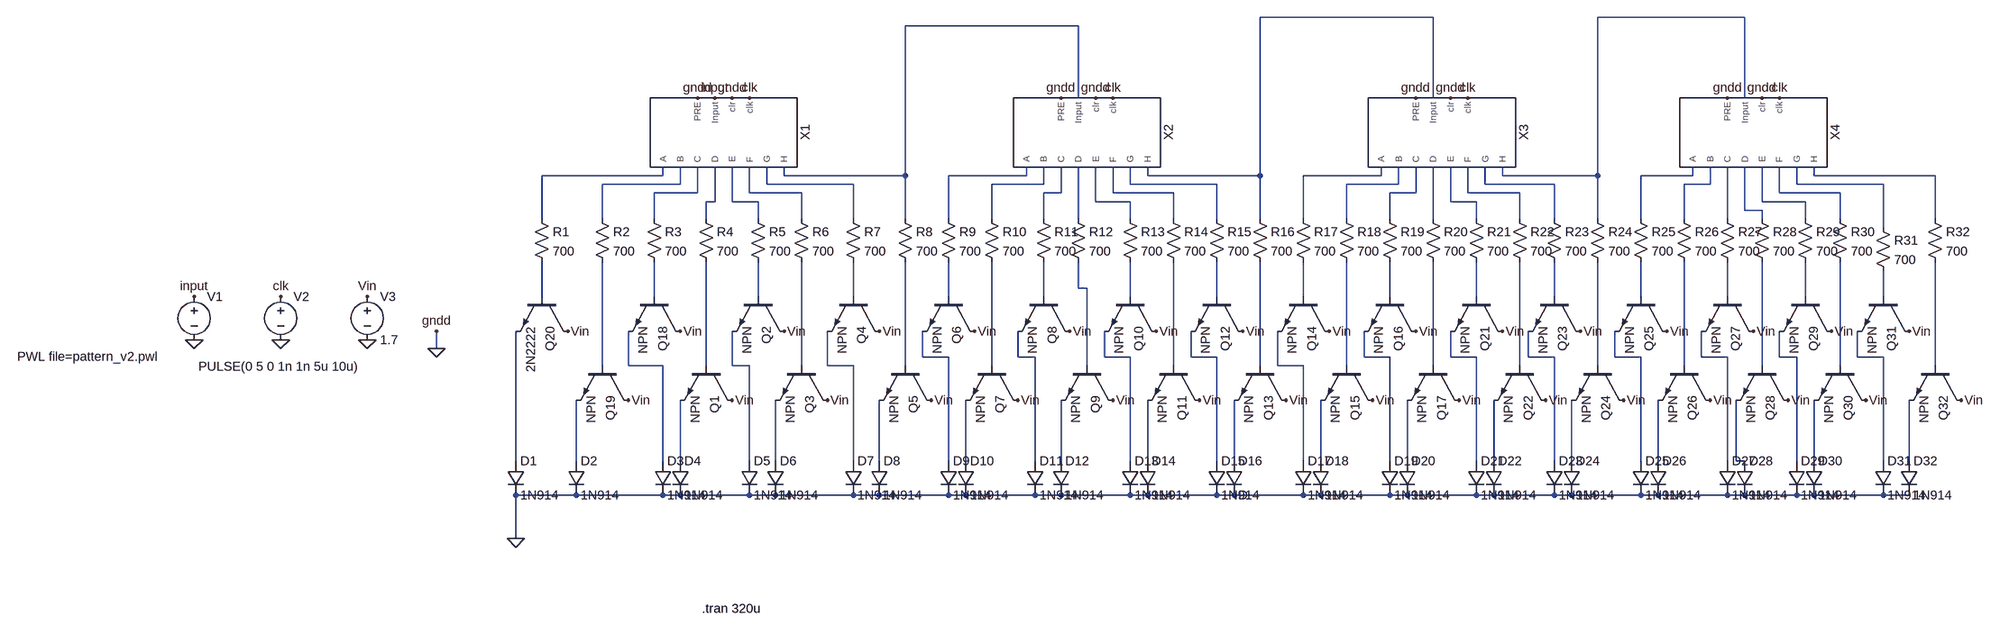
[diagram p0: schematic v2_arduino_control.asc]
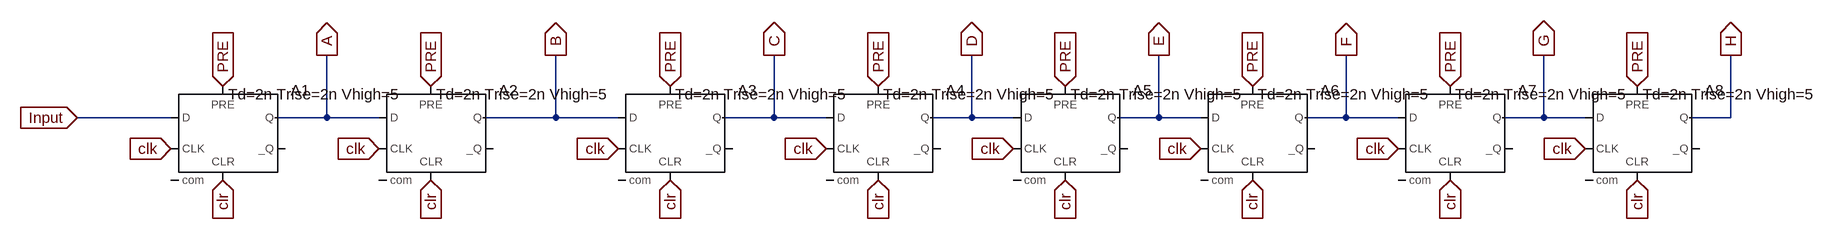
[diagram p1: sub-circuit shift_register.asc]
v2_arduino_control.asc, the LTspice schematic file:
Version 4.1
SHEET 1 2168 1000
WIRE 1120 -144 800 -144
WIRE 1696 -144 1424 -144
WIRE 464 -128 144 -128
WIRE 464 32 464 -128
WIRE 1120 32 1120 -144
WIRE 1696 32 1696 -144
WIRE -304 176 -304 160
WIRE -304 176 -528 176
WIRE -80 176 -80 160
WIRE 144 176 144 -128
WIRE 144 176 -80 176
WIRE 368 176 368 160
WIRE 368 176 224 176
WIRE 592 176 592 160
WIRE 800 176 800 -144
WIRE 800 176 592 176
WIRE 1024 176 1024 160
WIRE 1024 176 880 176
WIRE 1248 176 1248 160
WIRE 1424 176 1424 -144
WIRE 1424 176 1248 176
WIRE 1600 176 1600 160
WIRE 1600 176 1504 176
WIRE 1824 176 1824 160
WIRE 2048 176 1824 176
WIRE -272 192 -272 160
WIRE -272 192 -416 192
WIRE -112 192 -112 160
WIRE 48 192 -112 192
WIRE 400 192 400 160
WIRE 400 192 304 192
WIRE 560 192 560 160
WIRE 720 192 560 192
WIRE 1056 192 1056 160
WIRE 1056 192 960 192
WIRE 1216 192 1216 160
WIRE 1344 192 1216 192
WIRE 1632 192 1632 160
WIRE 1632 192 1584 192
WIRE 1792 192 1792 160
WIRE 1952 192 1792 192
WIRE -240 208 -240 160
WIRE -240 208 -320 208
WIRE -144 208 -144 160
WIRE -48 208 -144 208
WIRE 432 208 432 160
WIRE 432 208 400 208
WIRE 528 208 528 160
WIRE 640 208 528 208
WIRE 1088 208 1088 160
WIRE 1088 208 1040 208
WIRE 1184 208 1184 160
WIRE 1280 208 1184 208
WIRE 1760 208 1760 160
WIRE 1872 208 1760 208
WIRE -208 224 -208 160
WIRE -208 224 -224 224
WIRE -176 224 -176 160
WIRE -128 224 -176 224
WIRE 496 224 496 160
WIRE 560 224 496 224
WIRE 1152 224 1152 160
WIRE 1200 224 1152 224
WIRE 1728 224 1728 160
WIRE 1808 224 1728 224
WIRE 1696 240 1696 160
WIRE 1728 240 1696 240
WIRE -528 256 -528 176
WIRE -416 256 -416 192
WIRE -320 256 -320 208
WIRE -224 256 -224 224
WIRE -128 256 -128 224
WIRE -48 256 -48 208
WIRE 48 256 48 192
WIRE 144 256 144 176
WIRE 224 256 224 176
WIRE 304 256 304 192
WIRE 400 256 400 208
WIRE 464 256 464 160
WIRE 560 256 560 224
WIRE 640 256 640 208
WIRE 720 256 720 192
WIRE 800 256 800 176
WIRE 880 256 880 176
WIRE 960 256 960 192
WIRE 1040 256 1040 208
WIRE 1120 256 1120 160
WIRE 1200 256 1200 224
WIRE 1280 256 1280 208
WIRE 1344 256 1344 192
WIRE 1424 256 1424 176
WIRE 1504 256 1504 176
WIRE 1584 256 1584 192
WIRE 1664 256 1664 160
WIRE 1728 256 1728 240
WIRE 1808 256 1808 224
WIRE 1872 256 1872 208
WIRE 2048 256 2048 176
WIRE 1952 272 1952 192
WIRE 464 384 464 336
WIRE 480 384 464 384
WIRE -528 400 -528 336
WIRE -320 400 -320 336
WIRE -128 400 -128 336
WIRE 48 400 48 336
WIRE 224 400 224 336
WIRE 400 400 400 336
WIRE 560 400 560 336
WIRE 720 400 720 336
WIRE 880 400 880 336
WIRE 1040 400 1040 336
WIRE 1200 400 1200 336
WIRE 1344 400 1344 336
WIRE 1504 400 1504 336
WIRE 1664 400 1664 336
WIRE 1808 400 1808 336
WIRE 1952 400 1952 352
WIRE -816 496 -816 464
WIRE 176 512 176 464
WIRE 224 512 176 512
WIRE 352 512 352 464
WIRE 384 512 352 512
WIRE 512 512 512 464
WIRE 560 512 512 512
WIRE 672 512 672 464
WIRE 720 512 672 512
WIRE 992 512 992 464
WIRE 1040 512 992 512
WIRE 1152 512 1152 464
WIRE 1200 512 1152 512
WIRE 1296 512 1296 464
WIRE 1344 512 1296 512
WIRE 1456 512 1456 464
WIRE 1504 512 1456 512
WIRE 1616 512 1616 464
WIRE 1664 512 1616 512
WIRE 1760 512 1760 464
WIRE 1792 512 1760 512
WIRE 1904 512 1904 464
WIRE 1952 512 1904 512
WIRE -416 528 -416 336
WIRE -368 528 -368 464
WIRE -304 528 -368 528
WIRE -224 528 -224 336
WIRE -176 528 -176 464
WIRE -144 528 -176 528
WIRE -48 528 -48 336
WIRE 0 528 0 464
WIRE 48 528 0 528
WIRE 144 528 144 336
WIRE 304 528 304 336
WIRE 480 528 480 384
WIRE 640 528 640 336
WIRE 800 528 800 336
WIRE 832 528 832 464
WIRE 880 528 832 528
WIRE 960 528 960 336
WIRE 1120 528 1120 336
WIRE 1280 528 1280 336
WIRE 1424 528 1424 336
WIRE 1584 528 1584 336
WIRE 1728 528 1728 336
WIRE 1872 528 1872 336
WIRE 2048 528 2048 336
WIRE -576 704 -576 464
WIRE -464 704 -464 592
WIRE -304 704 -304 528
WIRE -272 704 -272 592
WIRE -144 704 -144 528
WIRE -96 704 -96 592
WIRE 48 704 48 528
WIRE 96 704 96 592
WIRE 224 704 224 512
WIRE 256 704 256 592
WIRE 384 704 384 512
WIRE 432 704 432 592
WIRE 560 704 560 512
WIRE 592 704 592 592
WIRE 720 704 720 512
WIRE 752 704 752 592
WIRE 880 704 880 528
WIRE 912 704 912 592
WIRE 1040 704 1040 512
WIRE 1072 704 1072 592
WIRE 1200 704 1200 512
WIRE 1232 704 1232 592
WIRE 1344 704 1344 512
WIRE 1376 704 1376 592
WIRE 1504 704 1504 512
WIRE 1536 704 1536 592
WIRE 1664 704 1664 512
WIRE 1680 704 1680 592
WIRE 1696 704 1680 704
WIRE 1792 704 1792 512
WIRE 1824 704 1824 592
WIRE 1952 704 1952 512
WIRE 2000 704 2000 592
WIRE -464 768 -576 768
WIRE -304 768 -464 768
WIRE -272 768 -304 768
WIRE -144 768 -272 768
WIRE -96 768 -144 768
WIRE 48 768 -96 768
WIRE 96 768 48 768
WIRE 224 768 96 768
WIRE 256 768 224 768
WIRE 384 768 256 768
WIRE 432 768 384 768
WIRE 560 768 432 768
WIRE 592 768 560 768
WIRE 720 768 592 768
WIRE 752 768 720 768
WIRE 880 768 752 768
WIRE 912 768 880 768
WIRE 1040 768 912 768
WIRE 1072 768 1040 768
WIRE 1200 768 1072 768
WIRE 1232 768 1200 768
WIRE 1344 768 1232 768
WIRE 1376 768 1344 768
WIRE 1504 768 1376 768
WIRE 1536 768 1504 768
WIRE 1664 768 1536 768
WIRE 1696 768 1664 768
WIRE 1792 768 1696 768
WIRE 1824 768 1792 768
WIRE 1952 768 1824 768
WIRE 2000 768 1952 768
WIRE -576 848 -576 768
FLAG -816 496 0
FLAG -816 464 gndd
FLAG -240 32 gndd
FLAG -176 32 gndd
FLAG 432 32 gndd
FLAG 496 32 gndd
FLAG 1088 32 gndd
FLAG 1152 32 gndd
FLAG 1664 32 gndd
FLAG 1728 32 gndd
FLAG -1264 480 0
FLAG -1104 480 0
FLAG -944 480 0
FLAG -1264 400 input
FLAG -208 32 input
FLAG -1104 400 clk
FLAG -144 32 clk
FLAG 528 32 clk
FLAG 1184 32 clk
FLAG 1760 32 clk
FLAG -944 400 Vin
FLAG -480 464 Vin
FLAG -368 592 Vin
FLAG -272 464 Vin
FLAG -176 592 Vin
FLAG -80 464 Vin
FLAG 0 592 Vin
FLAG 96 464 Vin
FLAG 192 592 Vin
FLAG 272 464 Vin
FLAG 352 592 Vin
FLAG 448 464 Vin
FLAG 528 592 Vin
FLAG 608 464 Vin
FLAG 688 592 Vin
FLAG 768 464 Vin
FLAG 848 592 Vin
FLAG 928 464 Vin
FLAG 1008 592 Vin
FLAG 1088 464 Vin
FLAG 1168 592 Vin
FLAG 1248 464 Vin
FLAG 1328 592 Vin
FLAG 1392 464 Vin
FLAG 1552 464 Vin
FLAG 1472 592 Vin
FLAG 1632 592 Vin
FLAG 1712 464 Vin
FLAG 1776 592 Vin
FLAG 1856 464 Vin
FLAG 1920 592 Vin
FLAG 2000 464 Vin
FLAG 2096 592 Vin
FLAG -576 848 0
SYMBOL shift_register -192 96 R90
SYMATTR InstName X1
SYMBOL shift_register 480 96 R90
SYMATTR InstName X2
SYMBOL shift_register 1136 96 R90
SYMATTR InstName X3
SYMBOL shift_register 1712 96 R90
SYMATTR InstName X4
SYMBOL npn -176 528 R90
SYMATTR InstName Q1
SYMBOL npn -80 400 R90
SYMATTR InstName Q2
SYMBOL npn 0 528 R90
SYMATTR InstName Q3
SYMBOL npn 96 400 R90
SYMATTR InstName Q4
SYMBOL npn 192 528 R90
SYMATTR InstName Q5
SYMBOL npn 272 400 R90
SYMATTR InstName Q6
SYMBOL npn 352 528 R90
SYMATTR InstName Q7
SYMBOL npn 448 400 R90
SYMATTR InstName Q8
SYMBOL npn 528 528 R90
SYMATTR InstName Q9
SYMBOL npn 608 400 R90
SYMATTR InstName Q10
SYMBOL npn 688 528 R90
SYMATTR InstName Q11
SYMBOL npn 768 400 R90
SYMATTR InstName Q12
SYMBOL npn 848 528 R90
SYMATTR InstName Q13
SYMBOL npn 928 400 R90
SYMATTR InstName Q14
SYMBOL npn 1008 528 R90
SYMATTR InstName Q15
SYMBOL npn 1088 400 R90
SYMATTR InstName Q16
SYMBOL npn 1168 528 R90
SYMATTR InstName Q17
SYMBOL npn -272 400 R90
SYMATTR InstName Q18
SYMBOL npn -368 528 R90
SYMATTR InstName Q19
SYMBOL npn -480 400 R90
SYMATTR InstName Q20
SYMATTR Value 2N2222
SYMBOL npn 1248 400 R90
SYMATTR InstName Q21
SYMBOL npn 1328 528 R90
SYMATTR InstName Q22
SYMBOL npn 1392 400 R90
SYMATTR InstName Q23
SYMBOL npn 1472 528 R90
SYMATTR InstName Q24
SYMBOL npn 1552 400 R90
SYMATTR InstName Q25
SYMBOL npn 1632 528 R90
SYMATTR InstName Q26
SYMBOL npn 1712 400 R90
SYMATTR InstName Q27
SYMBOL npn 1776 528 R90
SYMATTR InstName Q28
SYMBOL npn 1856 400 R90
SYMATTR InstName Q29
SYMBOL npn 1920 528 R90
SYMATTR InstName Q30
SYMBOL npn 2000 400 R90
SYMATTR InstName Q31
SYMBOL npn 2096 528 R90
SYMATTR InstName Q32
SYMBOL voltage -1264 384 R0
WINDOW 3 -327 127 Left 2
WINDOW 123 0 0 Left 0
WINDOW 39 0 0 Left 0
SYMATTR Value PWL file=pattern_v2.pwl
SYMATTR InstName V1
SYMBOL voltage -1104 384 R0
WINDOW 3 -152 145 Left 2
WINDOW 123 0 0 Left 0
WINDOW 39 0 0 Left 0
SYMATTR Value PULSE(0 5 0 1n 1n 5u 10u)
SYMATTR InstName V2
SYMBOL voltage -944 384 R0
WINDOW 123 0 0 Left 0
WINDOW 39 0 0 Left 0
SYMATTR InstName V3
SYMATTR Value 1.7
SYMBOL res -544 240 R0
SYMATTR InstName R1
SYMATTR Value 700
SYMBOL res -432 240 R0
SYMATTR InstName R2
SYMATTR Value 700
SYMBOL res -336 240 R0
SYMATTR InstName R3
SYMATTR Value 700
SYMBOL res -240 240 R0
SYMATTR InstName R4
SYMATTR Value 700
SYMBOL res -144 240 R0
SYMATTR InstName R5
SYMATTR Value 700
SYMBOL res -64 240 R0
SYMATTR InstName R6
SYMATTR Value 700
SYMBOL res 32 240 R0
SYMATTR InstName R7
SYMATTR Value 700
SYMBOL res 128 240 R0
SYMATTR InstName R8
SYMATTR Value 700
SYMBOL res 208 240 R0
SYMATTR InstName R9
SYMATTR Value 700
SYMBOL res 288 240 R0
SYMATTR InstName R10
SYMATTR Value 700
SYMBOL res 384 240 R0
SYMATTR InstName R11
SYMATTR Value 700
SYMBOL res 448 240 R0
SYMATTR InstName R12
SYMATTR Value 700
SYMBOL res 544 240 R0
SYMATTR InstName R13
SYMATTR Value 700
SYMBOL res 624 240 R0
SYMATTR InstName R14
SYMATTR Value 700
SYMBOL res 704 240 R0
SYMATTR InstName R15
SYMATTR Value 700
SYMBOL res 784 240 R0
SYMATTR InstName R16
SYMATTR Value 700
SYMBOL res 864 240 R0
SYMATTR InstName R17
SYMATTR Value 700
SYMBOL res 944 240 R0
SYMATTR InstName R18
SYMATTR Value 700
SYMBOL res 1024 240 R0
SYMATTR InstName R19
SYMATTR Value 700
SYMBOL res 1104 240 R0
SYMATTR InstName R20
SYMATTR Value 700
SYMBOL res 1184 240 R0
SYMATTR InstName R21
SYMATTR Value 700
SYMBOL res 1264 240 R0
SYMATTR InstName R22
SYMATTR Value 700
SYMBOL res 1328 240 R0
SYMATTR InstName R23
SYMATTR Value 700
SYMBOL res 1408 240 R0
SYMATTR InstName R24
SYMATTR Value 700
SYMBOL res 1488 240 R0
SYMATTR InstName R25
SYMATTR Value 700
SYMBOL res 1568 240 R0
SYMATTR InstName R26
SYMATTR Value 700
SYMBOL res 1648 240 R0
SYMATTR InstName R27
SYMATTR Value 700
SYMBOL res 1712 240 R0
SYMATTR InstName R28
SYMATTR Value 700
SYMBOL res 1792 240 R0
SYMATTR InstName R29
SYMATTR Value 700
SYMBOL res 1856 240 R0
SYMATTR InstName R30
SYMATTR Value 700
SYMBOL res 1936 256 R0
SYMATTR InstName R31
SYMATTR Value 700
SYMBOL res 2032 240 R0
SYMATTR InstName R32
SYMATTR Value 700
SYMBOL diode -592 704 R0
SYMATTR InstName D1
SYMATTR Value 1N914
SYMBOL diode -480 704 R0
SYMATTR InstName D2
SYMATTR Value 1N914
SYMBOL diode -320 704 R0
SYMATTR InstName D3
SYMATTR Value 1N914
SYMBOL diode -288 704 R0
SYMATTR InstName D4
SYMATTR Value 1N914
SYMBOL diode -160 704 R0
SYMATTR InstName D5
SYMATTR Value 1N914
SYMBOL diode -112 704 R0
SYMATTR InstName D6
SYMATTR Value 1N914
SYMBOL diode 32 704 R0
SYMATTR InstName D7
SYMATTR Value 1N914
SYMBOL diode 80 704 R0
SYMATTR InstName D8
SYMATTR Value 1N914
SYMBOL diode 208 704 R0
SYMATTR InstName D9
SYMATTR Value 1N914
SYMBOL diode 240 704 R0
SYMATTR InstName D10
SYMATTR Value 1N914
SYMBOL diode 368 704 R0
SYMATTR InstName D11
SYMATTR Value 1N914
SYMBOL diode 416 704 R0
SYMATTR InstName D12
SYMATTR Value 1N914
SYMBOL diode 544 704 R0
SYMATTR InstName D13
SYMATTR Value 1N914
SYMBOL diode 576 704 R0
SYMATTR InstName D14
SYMATTR Value 1N914
SYMBOL diode 704 704 R0
SYMATTR InstName D15
SYMATTR Value 1N914
SYMBOL diode 736 704 R0
SYMATTR InstName D16
SYMBOL diode 864 704 R0
SYMATTR InstName D17
SYMATTR Value 1N914
SYMBOL diode 896 704 R0
SYMATTR InstName D18
SYMATTR Value 1N914
SYMBOL diode 1024 704 R0
SYMATTR InstName D19
SYMATTR Value 1N914
SYMBOL diode 1056 704 R0
SYMATTR InstName D20
SYMATTR Value 1N914
SYMBOL diode 1184 704 R0
SYMATTR InstName D21
SYMATTR Value 1N914
SYMBOL diode 1216 704 R0
SYMATTR InstName D22
SYMATTR Value 1N914
SYMBOL diode 1328 704 R0
SYMATTR InstName D23
SYMATTR Value 1N914
SYMBOL diode 1360 704 R0
SYMATTR InstName D24
SYMATTR Value 1N914
SYMBOL diode 1488 704 R0
SYMATTR InstName D25
SYMATTR Value 1N914
SYMBOL diode 1520 704 R0
SYMATTR InstName D26
SYMATTR Value 1N914
SYMBOL diode 1648 704 R0
SYMATTR InstName D27
SYMATTR Value 1N914
SYMBOL diode 1680 704 R0
SYMATTR InstName D28
SYMATTR Value 1N914
SYMBOL diode 1776 704 R0
SYMATTR InstName D29
SYMATTR Value 1N914
SYMBOL diode 1808 704 R0
SYMATTR InstName D30
SYMATTR Value 1N914
SYMBOL diode 1936 704 R0
SYMATTR InstName D31
SYMATTR Value 1N914
SYMBOL diode 1984 704 R0
SYMATTR InstName D32
SYMATTR Value 1N914
TEXT -232 984 Left 2 !.tran 320u

shift_register.asc, the sub-circuit schematic file:
Version 4.1
SHEET 1 2264 680
WIRE -320 112 -464 112
WIRE -80 112 -80 16
WIRE -80 112 -160 112
WIRE 0 112 -80 112
WIRE 272 112 272 16
WIRE 272 112 160 112
WIRE 368 112 272 112
WIRE 608 112 608 16
WIRE 608 112 528 112
WIRE 688 112 608 112
WIRE 912 112 912 16
WIRE 912 112 848 112
WIRE 976 112 912 112
WIRE 1200 112 1200 16
WIRE 1200 112 1136 112
WIRE 1264 112 1200 112
WIRE 1488 112 1488 16
WIRE 1488 112 1424 112
WIRE 1568 112 1488 112
WIRE 1792 112 1792 16
WIRE 1792 112 1728 112
WIRE 1856 112 1792 112
WIRE 2080 112 2080 16
WIRE 2080 112 2016 112
FLAG 0 160 clk
IOPIN 0 160 In
FLAG 368 160 clk
IOPIN 368 160 In
FLAG -320 160 clk
IOPIN -320 160 In
FLAG 688 160 clk
IOPIN 688 160 In
FLAG 976 160 clk
IOPIN 976 160 In
FLAG 1264 160 clk
IOPIN 1264 160 In
FLAG 1568 160 clk
IOPIN 1568 160 In
FLAG 1856 160 clk
IOPIN 1856 160 In
FLAG -240 208 clr
IOPIN -240 208 In
FLAG 80 208 clr
IOPIN 80 208 In
FLAG 448 208 clr
IOPIN 448 208 In
FLAG 768 208 clr
IOPIN 768 208 In
FLAG 1056 208 clr
IOPIN 1056 208 In
FLAG 1344 208 clr
IOPIN 1344 208 In
FLAG 1648 208 clr
IOPIN 1648 208 In
FLAG 1936 208 clr
IOPIN 1936 208 In
FLAG -464 112 Input
IOPIN -464 112 In
FLAG -80 16 A
IOPIN -80 16 Out
FLAG 272 16 B
IOPIN 272 16 Out
FLAG 608 16 C
IOPIN 608 16 Out
FLAG 912 16 D
IOPIN 912 16 Out
FLAG 1200 16 E
IOPIN 1200 16 Out
FLAG 1488 16 F
IOPIN 1488 16 Out
FLAG 1792 16 G
IOPIN 1792 16 Out
FLAG 2080 16 H
IOPIN 2080 16 Out
FLAG -240 64 PRE
IOPIN -240 64 In
FLAG 80 64 PRE
IOPIN 80 64 In
FLAG 448 64 PRE
IOPIN 448 64 In
FLAG 768 64 PRE
IOPIN 768 64 In
FLAG 1056 64 PRE
IOPIN 1056 64 In
FLAG 1344 64 PRE
IOPIN 1344 64 In
FLAG 1648 64 PRE
IOPIN 1648 64 In
FLAG 1936 64 PRE
IOPIN 1936 64 In
SYMBOL Digital\\dflop -240 64 R0
WINDOW 39 8 12 Left 2
SYMATTR SpiceLine Td=2n Trise=2n Vhigh=5
SYMATTR InstName A1
SYMBOL Digital\\dflop 80 64 R0
WINDOW 39 8 12 Left 2
SYMATTR SpiceLine Td=2n Trise=2n Vhigh=5
SYMATTR InstName A2
SYMBOL Digital\\dflop 448 64 R0
WINDOW 39 8 12 Left 2
SYMATTR SpiceLine Td=2n Trise=2n Vhigh=5
SYMATTR InstName A3
SYMBOL Digital\\dflop 768 64 R0
WINDOW 39 8 12 Left 2
SYMATTR SpiceLine Td=2n Trise=2n Vhigh=5
SYMATTR InstName A4
SYMBOL Digital\\dflop 1056 64 R0
WINDOW 39 8 12 Left 2
SYMATTR SpiceLine Td=2n Trise=2n Vhigh=5
SYMATTR InstName A5
SYMBOL Digital\\dflop 1344 64 R0
WINDOW 39 8 12 Left 2
SYMATTR SpiceLine Td=2n Trise=2n Vhigh=5
SYMATTR InstName A6
SYMBOL Digital\\dflop 1648 64 R0
WINDOW 39 8 12 Left 2
SYMATTR SpiceLine Td=2n Trise=2n Vhigh=5
SYMATTR InstName A7
SYMBOL Digital\\dflop 1936 64 R0
WINDOW 39 8 12 Left 2
SYMATTR SpiceLine Td=2n Trise=2n Vhigh=5
SYMATTR InstName A8

The netlist it stands for:
* v2_arduino_control.asc
X§X1 clk 0 input 0 N003 N010 N018 N025 N024 N017 N009 N004 shift_register
X§X2 clk 0 N003 0 N001 N012 N020 N026 N030 N019 N011 N005 shift_register
X§X3 clk 0 N001 0 N002 N014 N022 N027 N031 N021 N013 N006 shift_register
X§X4 clk 0 N002 0 N008 N016 N023 N028 N029 N032 N015 N007 shift_register
Q1 Vin N063 N082 0 NPN
Q2 Vin N036 N064 0 NPN
Q3 Vin N065 N083 0 NPN
Q4 Vin N037 N066 0 NPN
Q5 Vin N067 N084 0 NPN
Q6 Vin N038 N050 0 NPN
Q7 Vin N068 N085 0 NPN
Q8 Vin N039 N051 0 NPN
Q9 Vin N033 N086 0 NPN
Q10 Vin N040 N052 0 NPN
Q11 Vin N069 N087 0 NPN
Q12 Vin N041 N053 0 NPN
Q13 Vin N070 N088 0 NPN
Q14 Vin N042 N071 0 NPN
Q15 Vin N072 N089 0 NPN
Q16 Vin N043 N054 0 NPN
Q17 Vin N073 N090 0 NPN
Q18 Vin N035 N062 0 NPN
Q19 Vin N061 N081 0 NPN
Q20 Vin N034 N080 0 2N2222
Q21 Vin N044 N055 0 NPN
Q22 Vin N074 N091 0 NPN
Q23 Vin N045 N056 0 NPN
Q24 Vin N075 N092 0 NPN
Q25 Vin N046 N057 0 NPN
Q26 Vin N076 N093 0 NPN
Q27 Vin N047 N058 0 NPN
Q28 Vin N077 N094 0 NPN
Q29 Vin N048 N059 0 NPN
Q30 Vin N078 N095 0 NPN
Q31 Vin N049 N060 0 NPN
Q32 Vin N079 N096 0 NPN
V1 input 0 PWL file=pattern_v2.pwl
V2 clk 0 PULSE(0 5 0 1n 1n 5u 10u)
V3 Vin 0 1.7
R1 N004 N034 700
R2 N009 N061 700
R3 N017 N035 700
R4 N024 N063 700
R5 N025 N036 700
R6 N018 N065 700
R7 N010 N037 700
R8 N003 N067 700
R9 N005 N038 700
R10 N011 N068 700
R11 N019 N039 700
R12 N030 N033 700
R13 N026 N040 700
R14 N020 N069 700
R15 N012 N041 700
R16 N001 N070 700
R17 N006 N042 700
R18 N013 N072 700
R19 N021 N043 700
R20 N031 N073 700
R21 N027 N044 700
R22 N022 N074 700
R23 N014 N045 700
R24 N002 N075 700
R25 N007 N046 700
R26 N015 N076 700
R27 N032 N047 700
R28 N029 N077 700
R29 N028 N048 700
R30 N023 N078 700
R31 N016 N049 700
R32 N008 N079 700
D1 N080 0 1N914
D2 N081 0 1N914
D3 N062 0 1N914
D4 N082 0 1N914
D5 N064 0 1N914
D6 N083 0 1N914
D7 N066 0 1N914
D8 N084 0 1N914
D9 N050 0 1N914
D10 N085 0 1N914
D11 N051 0 1N914
D12 N086 0 1N914
D13 N052 0 1N914
D14 N087 0 1N914
D15 N053 0 1N914
D16 N088 0 D
D17 N071 0 1N914
D18 N089 0 1N914
D19 N054 0 1N914
D20 N090 0 1N914
D21 N055 0 1N914
D22 N091 0 1N914
D23 N056 0 1N914
D24 N092 0 1N914
D25 N057 0 1N914
D26 N093 0 1N914
D27 N058 0 1N914
D28 N094 0 1N914
D29 N059 0 1N914
D30 N095 0 1N914
D31 N060 0 1N914
D32 N096 0 1N914

* block symbol definitions
.subckt shift_register clk clr Input PRE H G F E D C B A
A1 Input 0 clk PRE clr 0 A 0 DFLOP Td=2n Trise=2n Vhigh=5
A2 A 0 clk PRE clr 0 B 0 DFLOP Td=2n Trise=2n Vhigh=5
A3 B 0 clk PRE clr 0 C 0 DFLOP Td=2n Trise=2n Vhigh=5
A4 C 0 clk PRE clr 0 D 0 DFLOP Td=2n Trise=2n Vhigh=5
A5 D 0 clk PRE clr 0 E 0 DFLOP Td=2n Trise=2n Vhigh=5
A6 E 0 clk PRE clr 0 F 0 DFLOP Td=2n Trise=2n Vhigh=5
A7 F 0 clk PRE clr 0 G 0 DFLOP Td=2n Trise=2n Vhigh=5
A8 G 0 clk PRE clr 0 H 0 DFLOP Td=2n Trise=2n Vhigh=5
.ends shift_register

.model D D
.lib standard.dio
.model NPN NPN
.model PNP PNP
.lib standard.bjt
.tran 320u
.backanno
.end

* Results of the author's LTspice run, read from the files saved beside the schematic
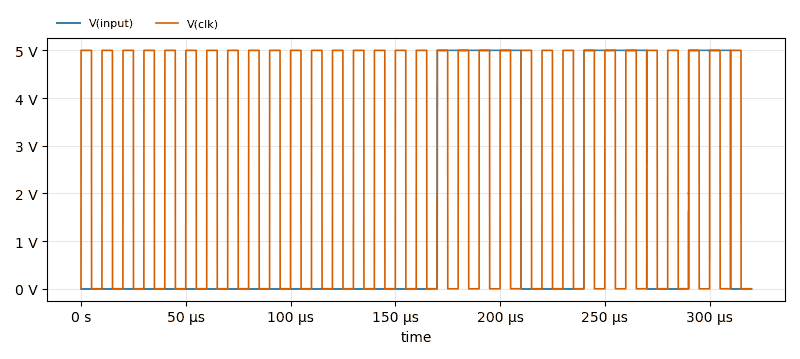
[diagram p2: Transient Analysis of v2_arduino_control.asc, plotted from the saved traces]
* Transient Analysis, 1 run:
*   V(input): min 0 V, max 5 V, average 1.406 V, rms 2.652 V, last 0 V
*   V(clk): min 0 V, max 5 V, average 2.5 V, rms 3.536 V, last 0 V